# Altium schematic sheet Brethalyzer_schematic.SchDoc
size A3; SheetNumber: 1; SheetTotal: 1
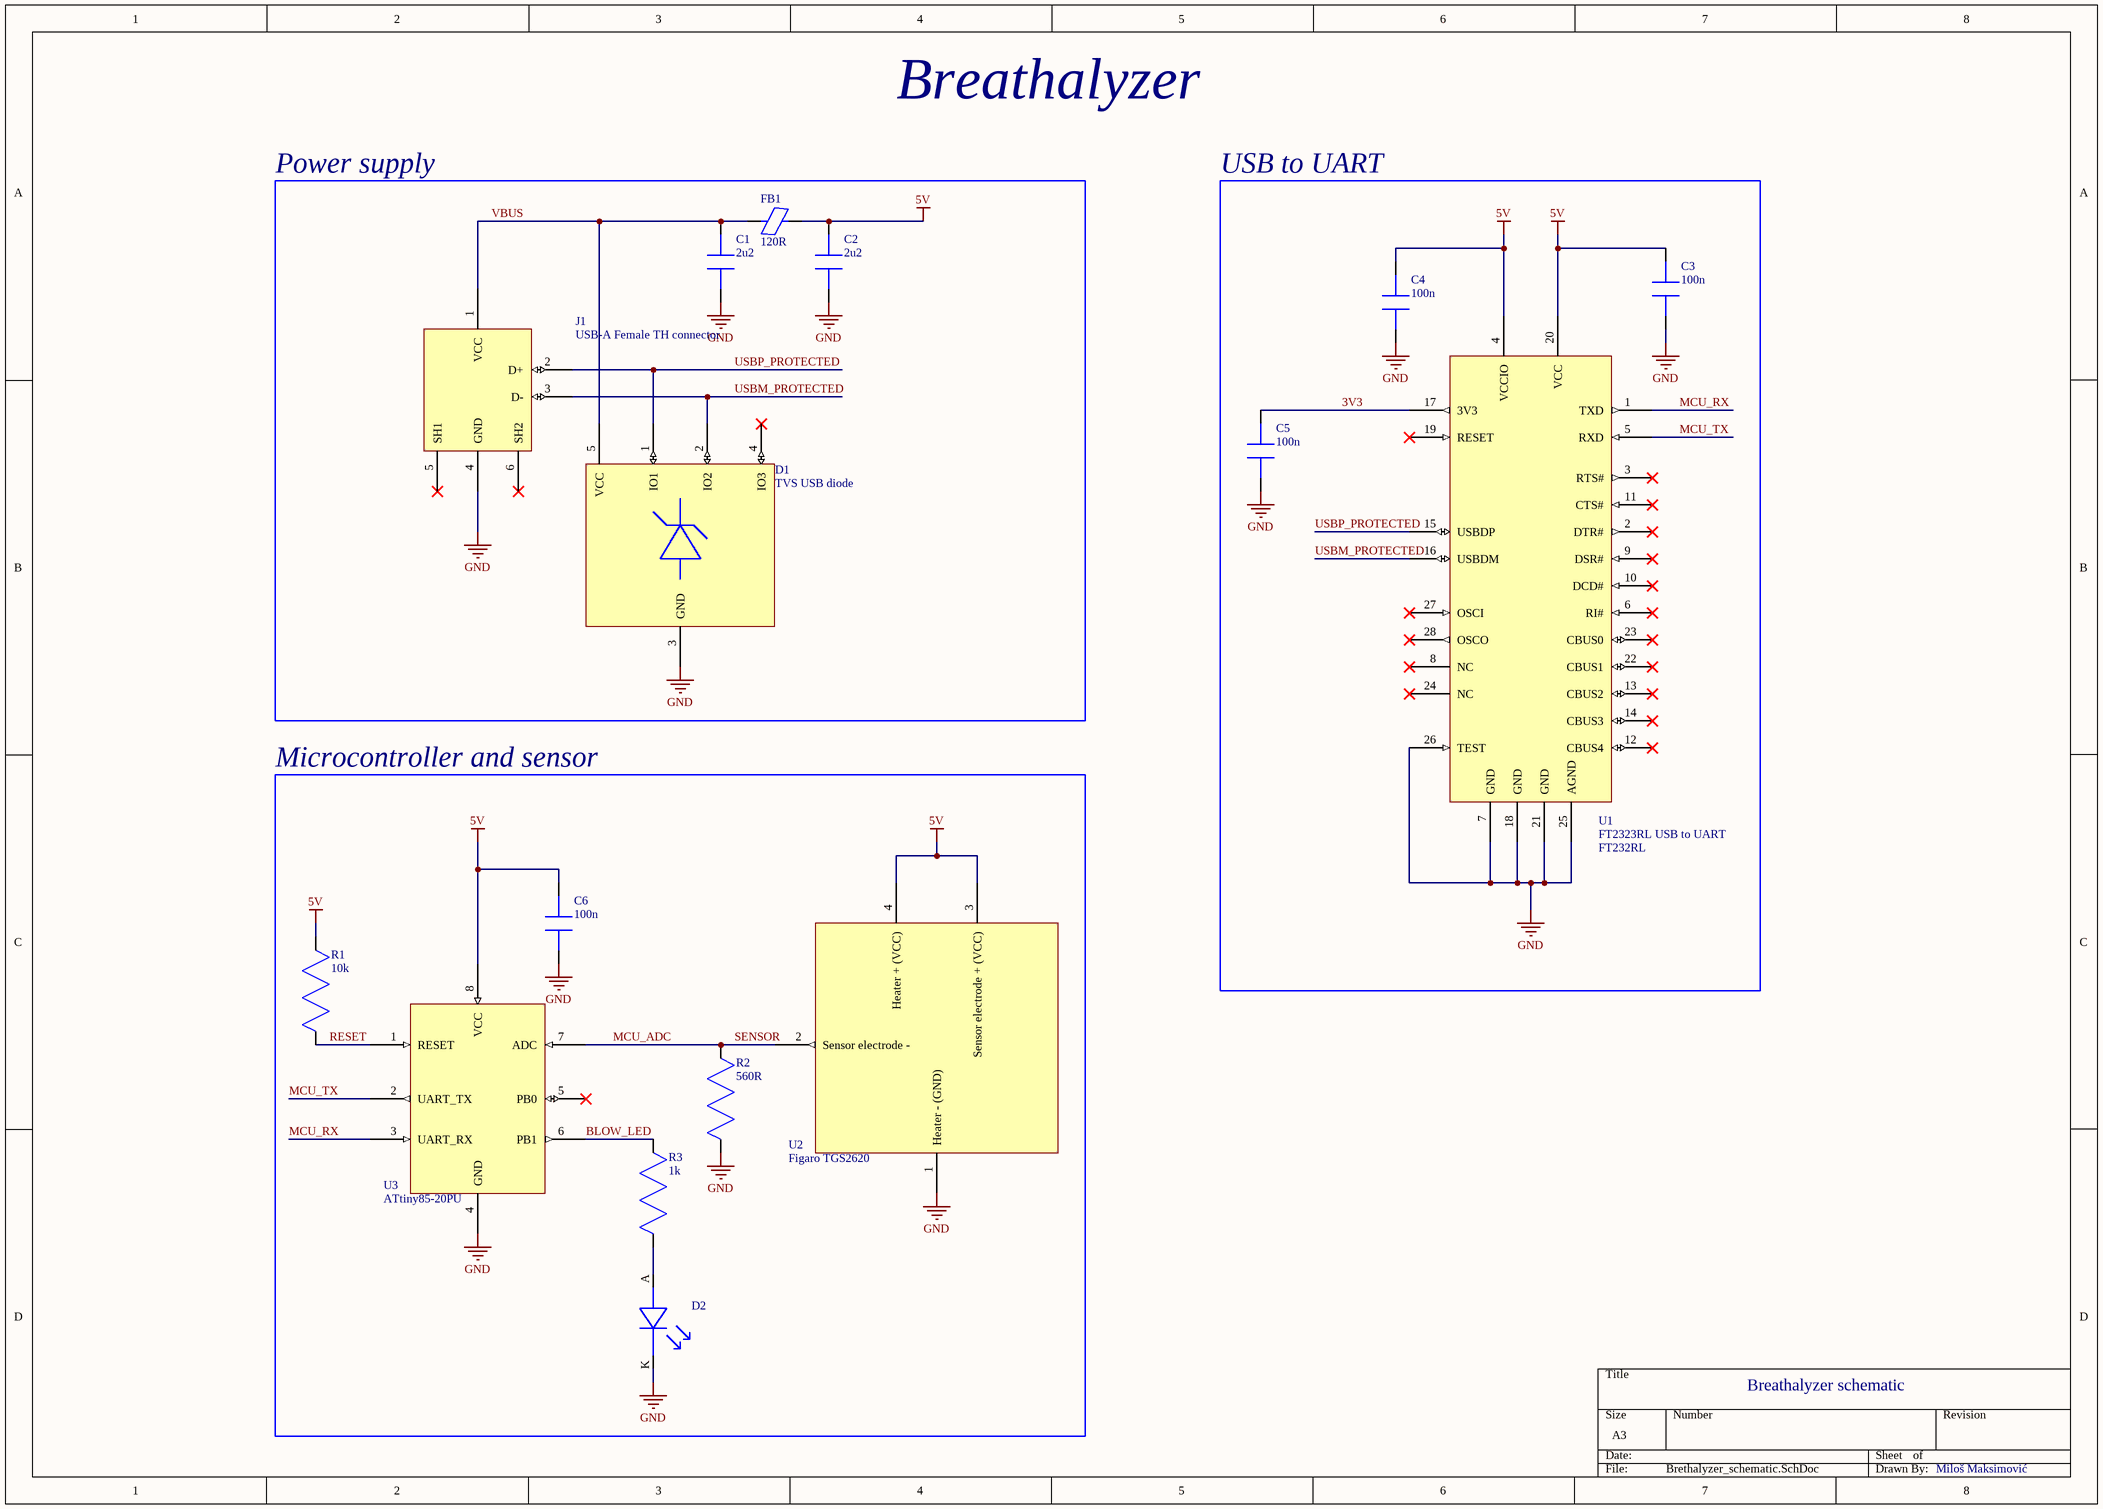
[diagram p0: Brethalyzer_schematic.SchDoc]

## Parts
C1  value 2u2  [Capacitor 0805]  (hidden comment: 0805 SMD Capacitor)
C2  value 2u2  [Capacitor 0805]  (hidden comment: 0805 SMD Capacitor)
C3  value 100n  [Capacitor 0805]  (hidden comment: 0805 SMD Capacitor)
C4  value 100n  [Capacitor 0805]  (hidden comment: 0805 SMD Capacitor)
C5  value 100n  [Capacitor 0805]  (hidden comment: 0805 SMD Capacitor)
C6  value 100n  [Capacitor 0805]  (hidden comment: 0805 SMD Capacitor)
D1  TVS USB diode  [TVS diode]
D2  0603 SMD LED  [0603 LED]  (value not drawn)
FB1  value 120R  [Ferrite bead]  (hidden comment: Ferrite bead)
J1  USB-A Female TH connector  [USB A Female TH connector]
R1  value 10k  [Resistor 0805]  (hidden comment: 0805 SMD resistor)
R2  value 560R  [Resistor 0805]  (hidden comment: 0805 SMD resistor)
R3  value 1k  [Resistor 0805]  (hidden comment: 0805 SMD resistor)
U1  FT2323RL USB to UART  Manufacturer Product Number: FT232RL  [SOP28]
U2  Figaro TGS2620  [TGS2620]
U3  ATtiny85-20PU  [DIP-8]

## Blocks framed on the sheet
Power supply: C1 C2 D1 FB1 J1
USB to UART: C3-C5 U1
Microcontroller and sensor: C6 D2 R1-R3 U2 U3

## Nets
5V: C2.1 C3.1 C4.1 C6.1 FB1.2 R1.2 U1.4(VCCIO) U1.20(VCC) U2.3(Sensor_electrode_+_(VCC)) U2.4(Heater_+_(VCC)) U3.8(VCC)
GND: C1.2 C2.2 C3.2 C4.2 C5.2 C6.2 D1.3(GND) D2.K J1.4(GND) R2.1 U1.7(GND) U1.18(GND) U1.21(GND) U1.25(AGND) U1.26(TEST) U2.1(Heater_-_(GND)) U3.4(GND)
3V3: C5.1 U1.17(3V3)
BLOW_LED: R3.2 U3.6(PB1)
MCU_ADC: R2.2 U2.2(Sensor_electrode_-) U3.7(ADC)  [also labelled SENSOR]
MCU_RX: U1.1(TXD) U3.3(UART_RX)
MCU_TX: U1.5(RXD) U3.2(UART_TX)
RESET: R1.1 U3.1(RESET)
USBM_PROTECTED: D1.2(IO2) J1.3(D-) U1.16(USBDM)
USBP_PROTECTED: D1.1(IO1) J1.2(D+) U1.15(USBDP)
VBUS: C1.1 D1.5(VCC) FB1.1 J1.1(VCC)
NetD2_A: D2.A R3.1

Not connected (* = marked no-connect by the designer): D1 4(IO3)*; J1 5(SH1)* 6(SH2)*; U1 2(DTR#)* 3(RTS#)* 6(RI#)* 8(NC)* 9(DSR#)* 10(DCD#)* 11(CTS#)* 12(CBUS4)* 13(CBUS2)* 14(CBUS3)* 19(RESET)* 22(CBUS1)* 23(CBUS0)* 24(NC)* 27(OSCI)* 28(OSCO)*; U3 5(PB0)*

## Notes on the sheet
- Breathalyzer
- Breathalyzer schematic
- Miloš Maksimović

## Library data of the parts
C1-C6 = 0805 Capacitor
D1 = TVS_diode: TVS DIODE 5.5VWM SOT5; Manufacturer: Texas Instruments; Manufacturer Product Number: TPD3E001DRLR
D2 = SMD0603_LED
FB1 = Ferrite bead: Ferrite Beads 0.6mm x 0.3mm x 0.3mm, -55 to +125 degC, 200mA, 120ohm, 390mohm; Manufacturer: TDK; Manufacturer Product Number: MMZ0603Y121CT000
J1 = USB-A Female
R1-R3 = 0805 Resistor
U1 = FT2323RL: USB Bridge, USB to UART USB 2.0 UART Interface 28-SSOP; Manufacturer: FTDI
U2 = TGS2620: Figaro TGS2620 gas sensor; Manufacturer: Figaro; Manufacturer Product Number: Figaro TGS2620
U3 = ATtiny85: AVR AVR® ATtiny, Functional Safety (FuSa) Microcontroller IC 8-Bit 20MHz 8KB (4K x 16) FLASH 8-PDIP; Manufacturer: Microchip Technology; Manufacturer Product Number: ATTINY85-20PU